# Altium schematic sheet 9-10-00222-7_Sheet1_REV02_062018.SchDoc: ZPW 204
size A; Revision: 02; SheetNumber: 1; SheetTotal: 3
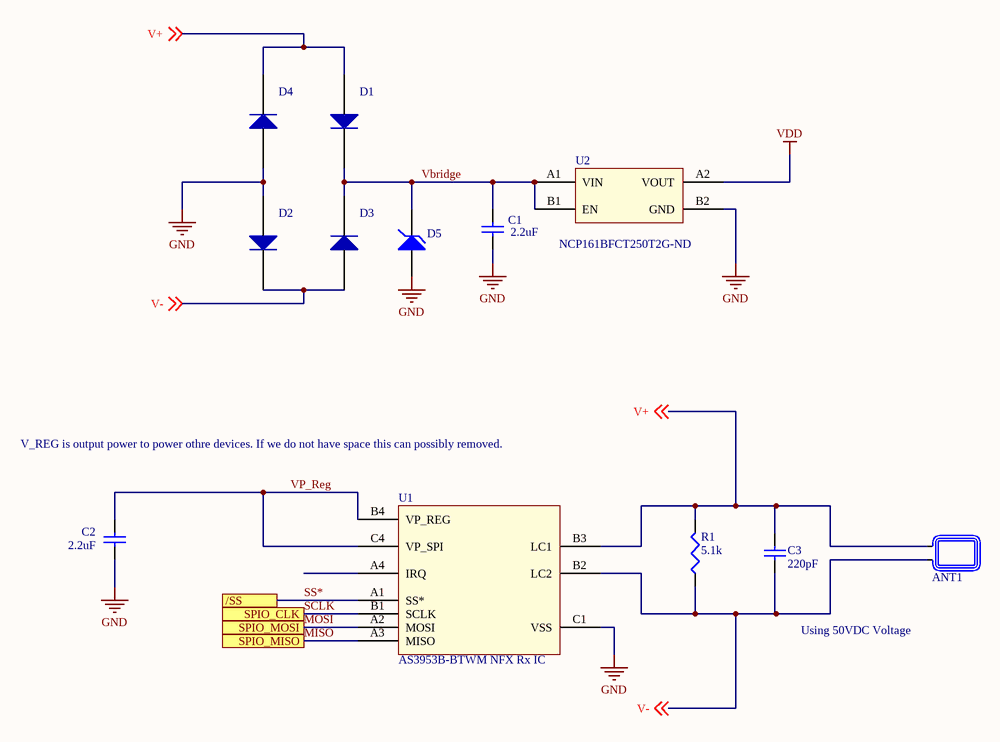
[diagram p0: 9-10-00222-7_Sheet1_REV02_062018.SchDoc]

## Parts
ANT1  (no value)  [NFC ANTENNA MOUNT - SMALL]  (no BOM)
C1  2.2uF  [CAPC0603X03L(0201)]
C2  2.2uF  [CAPC0603X03L(0201)]
C3  220pF  [CAPC0603X03L(0201)]
D1  497-15253-1-ND  [BAT30F4]  (value not drawn)
D2  497-15253-1-ND  [BAT30F4]  (value not drawn)
D3  497-15253-1-ND  [BAT30F4]  (value not drawn)
D4  497-15253-1-ND  [BAT30F4]  (value not drawn)
D5  GDZ4V7LP3-7DICT-ND  [DFN35P61X30-2N]  (value not drawn)
R1  5.1k  [RES1005X06L (0402 Imperial)]
U1  AS3953B-BTWM NFX Rx IC  [10-WLCSP]
U2  Supplier Part Number 1: NCP161BFCT250T2G-ND  [BGA4x2]  (hidden comment: 2.5V LDO 450mA non-active)

## Ports
/SS, SPIO_CLK, SPIO_MISO, SPIO_MOSI

## Nets
GND: C1.1 C2.1 D2.2 D4.2 D5.2(Anode) U1.C1(VSS) U2.B2(GND)
VDD: U2.A2(VOUT)
MISO: U1.A3(MISO) ; port SPIO_MISO
MOSI: U1.A2(MOSI) ; port SPIO_MOSI
SCLK: U1.B1(SCLK) ; port SPIO_CLK
SS*: U1.A1(SS*) ; port /SS
V+: ANT1.1 C3.1 D1.2 D4.1 R1.1 U1.B3(LC1) ; off-sheet V+
V-: ANT1.2 C3.2 D2.1 D3.2 R1.2 U1.B2(LC2) ; off-sheet V-
Vbridge: C1.2 D1.1 D3.1 D5.1(Cathode) U2.A1(VIN) U2.B1(EN)
VP_Reg: C2.2 U1.B4(VP_REG) U1.C4(VP_SPI)

Not connected (* = marked no-connect by the designer): U1 A4(IRQ)

## Notes on the sheet
- V_REG is output power to power othre devices. If we do not have space this can possibly removed.
- Using 50VDC Voltage
- Title
- ZPOWER CONFIDENTIAL AND PROPRIETARY
- Size:
- Date:
- A
- Number:
- Time:
- Revision:
- Sheet        of
- File:

## Library data of the parts
ANT1 = NFC_Antenna: NFC Antenna
C1 C2 = Cap Semi: CAP CER 2.2UF 6.3V X5R 0201; Manufacturer Part Number: GRM033R60J225ME47D; Manufacturer: Murata; Tolerance: 20%; CM BOM: X; Published: 8-Jun-2000; LatestRevisionDate: 29-May-2009; LatestRevisionNote: IPC-7351 Footprint Added.; Publisher: Altium Limited; PackageDescription: Chip Capacitor, 0603; Value: 2.2uF; Supplier1 Part Number: 490-13225-2-ND; Supplier1: Digi-Key; Package: 0201; Type: CAP; Voltage Rating: 6.3V
C3 = Cap: Capacitor; Manufacturer: Murata; Manufacturer Part Number: GRM0335C1H221JA01D; Catalog Drawings: GRM Series_0201; Tolerance: ±5%; Voltage - Rated: 50V; Temperature Coefficient: C0G, NP0; Supplier 1: Digikey; Supplier Part Number 1: 490-11316-2-ND; Pricing 1: 1=0.1, 10=0.01, 100=0.0037, 500=0.0027, 1000=0.0021, 2500=0.0019, 5000=0.0018 (USD); Standard Package: 15,000; Category: Capacitors; Family: Ceramic Capacitors; Series: GRM; Packaging: Tape & Reel (TR); Capacitance: 220pF; Mounting Type: Surface Mount, MLCC; Operating Temperature: -55°C ~ 125°C; Applications: General Purpose; Ratings: -; Package / Case: 0201 (0603 Metric); Size / Dimension: 0.024" L x 0.012" W (0.60mm x 0.30mm); Thickness (Max): 0.013" (0.33mm); ComponentLink1URL: http://components.arrow.com/part/dataview/0323_06471816; ComponentLink1Description: http://components.arrow.com/part/dataview/0323_06471816; ComponentLink2URL: http://search.murata.co.jp/Ceramy/image/img/A01X/partnumbering_e_01.pdf; ComponentLink2Description: http://search.murata.co.jp/Ceramy/image/img/A01X/partnumbering_e_01.pdf; ComponentLink3URL: http://psearch.murata.com/capacitor/product/GRM0335C1H390JA01%23.pdf; ComponentLink3Description: http://psearch.murata.com/capacitor/product/GRM0335C1H390JA01%23.pdf; ComponentLink4URL: http://psearch.en.murata.com/capacitor/product/GRM0335C1H390JA01%23.pdf; ComponentLink4Description: http://psearch.en.murata.com/capacitor/product/GRM0335C1H390JA01%23.pdf
D1-D4 = BAT30F4: DIODE SCHOTTKY; Manufacturer: STMicroelectronics; Voltage - DC Reverse (Vr) (Max): 30V; Current - Average Rectified (Io): 300mA; Voltage - Forward (Vf) (Max) @ If: 310mV @ 10mA; Speed: Fast Recovery =  200mA (Io); Current - Reverse Leakage @ Vr: 50µA @ 30V; Supplier 1: Digikey; Supplier Part Number 1: 497-15253-1-ND; Manufacturer Part Number: BAT30F4; Stock 1: 40093; Pricing 1: 1=0.4, 10=0.326, 100=0.1726, 500=0.1136, 1000=0.0772 (USD); Category: Discrete Semiconductor Products; Family: Diodes - Rectifiers - Single; Series: -; Packaging: Tape &amp; Reel (TR); Diode Type: Schottky; Reverse Recovery Time (trr): -; Capacitance @ Vr, F: -; Mounting Type: Surface Mount; Package / Case: 2-XFDFN; Supplier Device Package: 0201; Operating Temperature - Junction: -30°C ~ 85°C; ComponentLink1URL: http://www.farnell.com/datasheets/1880978.pdf; ComponentLink1Description: http://www.farnell.com/datasheets/1880978.pdf; ComponentLink2URL: http://www.farnell.com/datasheets/1865111.pdf; ComponentLink2Description: http://www.farnell.com/datasheets/1865111.pdf; ComponentLink3URL: http://www.st.com/st-web-ui/st@ic/active/en/resource/technical/document/datasheet/DM00104747.pdf; ComponentLink3Description: http://www.st.com/st-web-ui/st@ic/active/en/resource/technical/document/datasheet/DM00104747.pdf; ComponentLink4URL: http://www.st.com/st-web-ui/static/active/en/resource/technical/document/datasheet/DM00104747.pdf; ComponentLink4Description: http://www.st.com/st-web-ui/static/active/en/resource/technical/document/datasheet/DM00104747.pdf
D5 = GDZ4V7LP3-7: DIODE ZENER 4.7V 250MW 2DFN; Manufacturer: Diodes; Proven: False; Current - Reverse Leakage @ Vr: 2µA @ 1V; Supplier 1: Digikey; Supplier Part Number 1: GDZ4V7LP3-7DICT-ND; Manufacturer Part Number: GDZ4V7LP3-7; Stock 1: 5000; Pricing 1: 1=0.37, 10=0.304, 100=0.1615, 500=0.1062, 1000=0.0722 (USD); Category: Discrete Semiconductor Products; Family: Diodes - Zener - Single; Series: Automotive, AEC-Q101; Packaging: Tape & Reel (TR); Voltage - Zener (Nom) (Vz): 4.7V; Tolerance: -; Power - Max: 250mW; Impedance (Max) (Zzt): -; Voltage - Forward (Vf) (Max) @ If: -; Operating Temperature: -55°C ~ 150°C (TA); Mounting Type: Surface Mount; Package / Case: 2-XFDFN; Supplier Device Package: 2-X3-DFN0603; ComponentLink1URL: https://datasheet.ciiva.com/29597/gdzxvxlp3-29597945.pdf; ComponentLink1Description: https://datasheet.ciiva.com/29597/gdzxvxlp3-29597945.pdf; ComponentLink2URL: https://datasheet.ciiva.com/29597/gdzxvxlp3-29597946.pdf; ComponentLink2Description: https://datasheet.ciiva.com/29597/gdzxvxlp3-29597946.pdf; ComponentLink3URL: https://datasheet.ciiva.com/29597/gdzxvxlp3-29597947.pdf; ComponentLink3Description: https://datasheet.ciiva.com/29597/gdzxvxlp3-29597947.pdf
R1 = Resistor: RES SMD 5.1KOHM 0.25% 1/16W 0402; Manufacturer: Panasonic; Manufacturer Part Number: ERA-2ARC512X; Power (Watts): 0.063W, 1/16W; Supplier1: Digikey; Supplier1 Part Number: P5.1KCQCT-ND; Category: Resistors; Family: Chip Resistor - Surface Mount; Resistance (Ohms): 5.1k; Tolerance: ±0.25%; Package / Case: 0402; Supplier Device Package: 0402; Number of Terminations: 2
U1 = AS3953A_WLCSP: IC NFC INTERFACE 14443A LEVEL4; Manufacturer: austriamicrosystems (ams); Memory Size: 1 kbit; Brand: ams; Frequency: 13.56 MHz; Function: Designed to create a fast data link between an ISO 14443A reader device (PCD) and a microcontroller; Supplier 1: Digikey; Manufacturer Part Number: AS3953B-BTWM; Stock 1: 0; Pricing 1: 12000=0.4121 (USD); Product Category: RFID Transponders; RoHS: Details; Operating Temperature Range: - 40 C to + 85 C; Mounting Style: SMD/SMT; Package / Case: WLCSP-10; Packaging: Reel; Maximum Operating Temperature: + 85 C; Minimum Operating Temperature: - 40 C; Series: AS3953; Factory Pack Quantity: 12000; ComponentLink1URL: http://www.mouser.com/ds/2/588/AS3953A_Datasheet_EN_v1-253125.pdf; ComponentLink1Description: http://www.mouser.com/ds/2/588/AS3953A_Datasheet_EN_v1-253125.pdf; ComponentLink2URL: http://www.ams.com/eng/content/download/325044/1140864/78495; ComponentLink2Description: http://www.ams.com/eng/content/download/325044/1140864/78495; Supplier Part Number 1: AS3953B-BTWMCT-ND
U2 = NCP161BFCT250T2G: LDO Voltage Regulators CSP LDO 450MA NON-ACTIVE; Manufacturer: OnSemi; Manufacturer Part Number: LDBL20D-25R; Regulator Topology: Positive Fixed; Current - Output: 200mA; Number of Regulators: 1; Voltage - Input: Up to 5.5V; Category: Integrated Circuits (ICs); Family: PMIC - Voltage Regulators - Linear; Series: -; Packaging: Tape & Reel (TR); Voltage - Output: 2.5V; Voltage - Dropout (Typical): -; Current - Limit (Min): -; Operating Temperature: -40°C ~ 125°C; Mounting Type: Surface Mount; Package / Case: 4-STSTAMP™; Supplier Device Package: 4-STSTAMP™; Supplier 1: Digi-Key